# Altium schematic sheet Sheet1.SchDoc
size A
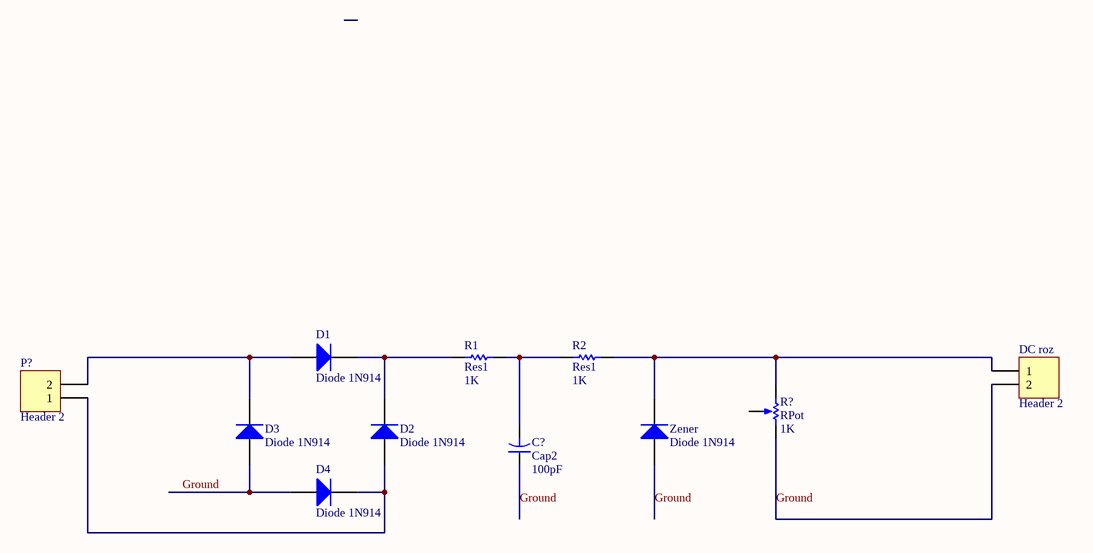
[diagram p0: Sheet1.SchDoc]

## Parts
C?  Cap2  value 100pF  [CAPR5-4X5]
D1  Diode 1N914  [DO-35]
D2  Diode 1N914  [DO-35]
D3  Diode 1N914  [DO-35]
D4  Diode 1N914  [DO-35]
DC_roz  Header 2  [HDR1X2]
P?  Header 2  [HDR1X2]
R1  Res1  value 1K  [AXIAL-0.3]
R2  Res1  value 1K  [AXIAL-0.3]
R?  RPot  value 1K  [VR5]
Zener  Diode 1N914  [DO-35]

## Nets
Ground: C?.1 D3.1(A) D4.1(A) DC_roz.2 R?.2(BOT) Zener.1(A)
NetC?_2: C?.2 R1.2 R2.1
NetD1_1: D1.1(A) D3.2(K) P?.2
NetD1_2: D1.2(K) D2.2(K) R1.1
NetD2_1: D2.1(A) D4.2(K) P?.1
NetDC_roz_1: DC_roz.1 R2.2 R?.1(TOP) Zener.2(K)

Not connected (* = marked no-connect by the designer): R? 3(TAP)

## Library data of the parts
C? = Cap2: Capacitor; Published: 23-Sep-2002; PackageReference: CAPR5-4X5; Publisher: Altium Limited; PackageDescription: Capacitor; 2 Leads
D1-D4 Zener = Diode 1N914: High Conductance Fast Diode; Published: 8-Jun-2000; LatestRevisionDate: 17-Jul-2002; LatestRevisionNote: Re-released for DXP Platform.; DatasheetVersion: 1997; PackageReference: DO-35; Publisher: Altium Limited; PackageDescription: Diode, Axial; Body 3.8 x 1.9 mm (LxDia. max), Lead Dia. 0.53 mm (max); Code_JEDEC: DO-204-AH; ComponentLink1Description: Manufacturer Link; ComponentLink1URL: http://www.fairchildsemi.com/; ComponentLink2Description: Datasheet; ComponentLink2URL: http://www.fairchildsemi.com/ds/1N%2F1N4448.pdf
DC_roz P? = Header 2: Header, 2-Pin; LatestRevisionDate: 17-Jul-2002; LatestRevisionNote: Re-released for DXP Platform.; Publisher: Altium Limited
R1 R2 = Res1: Resistor; Published: 8-Jun-2000; LatestRevisionDate: 17-Jul-2002; LatestRevisionNote: Re-released for DXP Platform.; PackageReference: AXIAL-0.3; Publisher: Altium Limited; PackageDescription: Axial Device, Thru-Hole; 2 Leads; 0.3 in Pin Spacing
R? = RPot: Potentiometer; Sim Note: Enter the Resistance value and the set point into parameter fields.; Set Position: 0.5; Published: 8-Jun-2000; LatestRevisionDate: 17-Jul-2002; LatestRevisionNote: Re-released for DXP Platform.; PackageReference: VR5; Publisher: Altium Limited; PackageDescription: Variable Resistor, Thru-Hole; 3 Leads